# Altium schematic sheet relays2.SchDoc
size A4
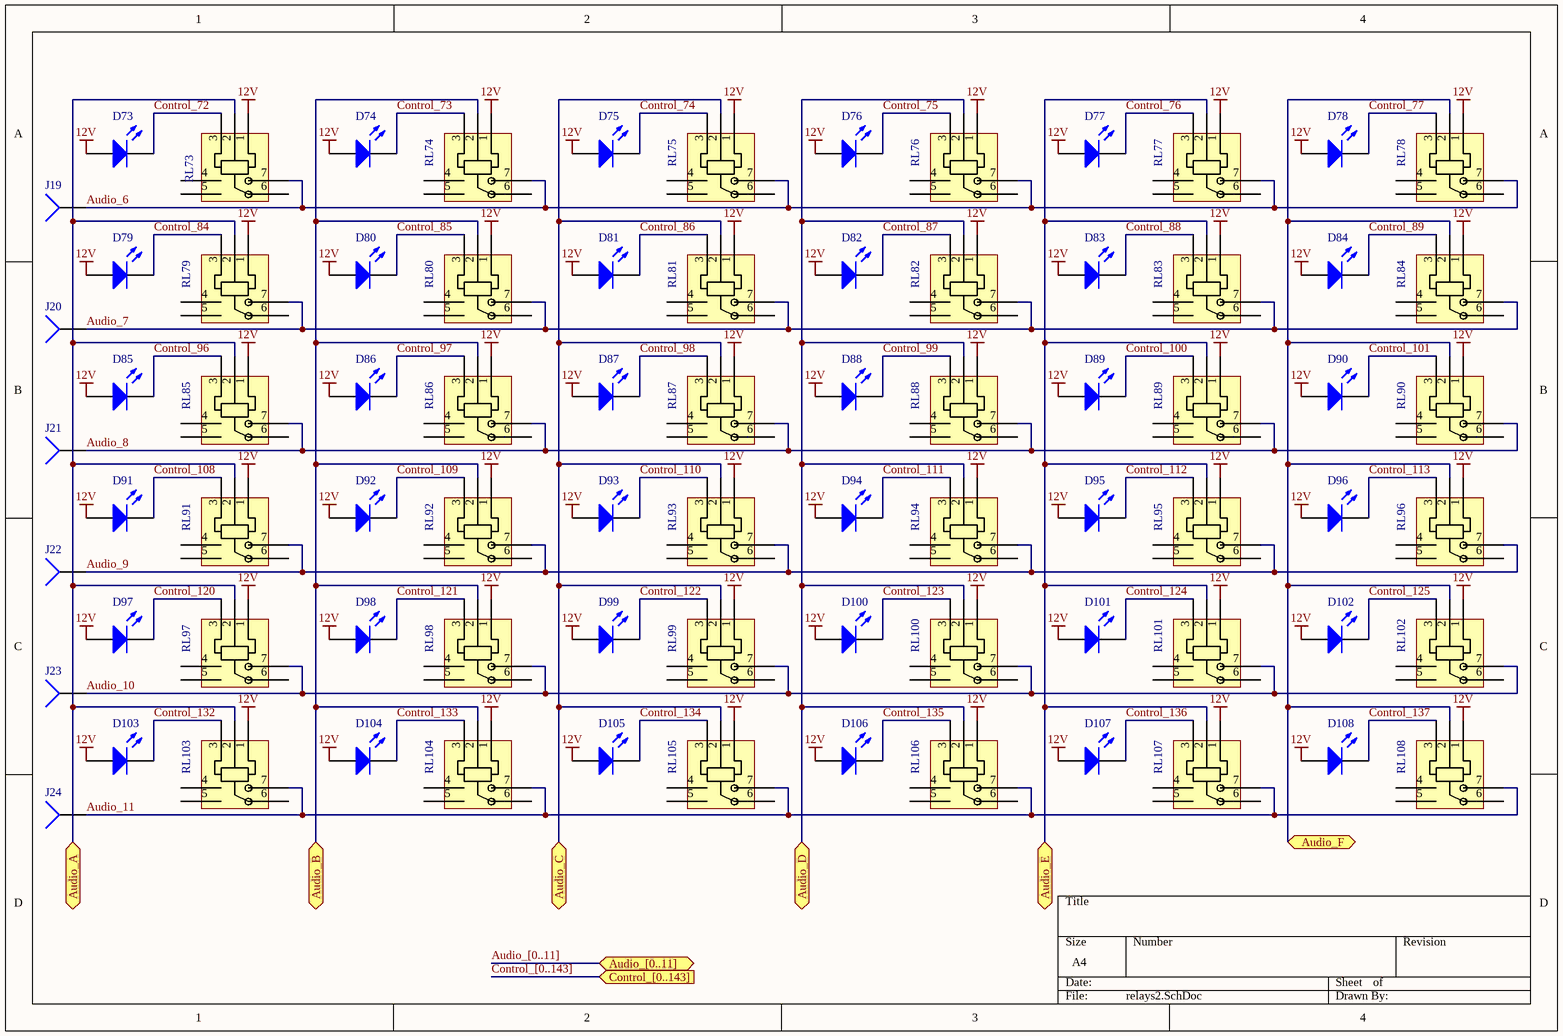
[diagram p0: relays2.SchDoc]

## Parts
D73  LED0  [LED_round_5mm]  (value not drawn)
D74  LED0  [LED_round_5mm]  (value not drawn)
D75  LED0  [LED_round_5mm]  (value not drawn)
D76  LED0  [LED_round_5mm]  (value not drawn)
D77  LED0  [LED_round_5mm]  (value not drawn)
D78  LED0  [LED_round_5mm]  (value not drawn)
D79  LED0  [LED_round_5mm]  (value not drawn)
D80  LED0  [LED_round_5mm]  (value not drawn)
D81  LED0  [LED_round_5mm]  (value not drawn)
D82  LED0  [LED_round_5mm]  (value not drawn)
D83  LED0  [LED_round_5mm]  (value not drawn)
D84  LED0  [LED_round_5mm]  (value not drawn)
D85  LED0  [LED_round_5mm]  (value not drawn)
D86  LED0  [LED_round_5mm]  (value not drawn)
D87  LED0  [LED_round_5mm]  (value not drawn)
D88  LED0  [LED_round_5mm]  (value not drawn)
D89  LED0  [LED_round_5mm]  (value not drawn)
D90  LED0  [LED_round_5mm]  (value not drawn)
D91  LED0  [LED_round_5mm]  (value not drawn)
D92  LED0  [LED_round_5mm]  (value not drawn)
D93  LED0  [LED_round_5mm]  (value not drawn)
D94  LED0  [LED_round_5mm]  (value not drawn)
D95  LED0  [LED_round_5mm]  (value not drawn)
D96  LED0  [LED_round_5mm]  (value not drawn)
D97  LED0  [LED_round_5mm]  (value not drawn)
D98  LED0  [LED_round_5mm]  (value not drawn)
D99  LED0  [LED_round_5mm]  (value not drawn)
D100  LED0  [LED_round_5mm]  (value not drawn)
D101  LED0  [LED_round_5mm]  (value not drawn)
D102  LED0  [LED_round_5mm]  (value not drawn)
D103  LED0  [LED_round_5mm]  (value not drawn)
D104  LED0  [LED_round_5mm]  (value not drawn)
D105  LED0  [LED_round_5mm]  (value not drawn)
D106  LED0  [LED_round_5mm]  (value not drawn)
D107  LED0  [LED_round_5mm]  (value not drawn)
D108  LED0  [LED_round_5mm]  (value not drawn)
J19  Audio  [Conn_1_2x4]  (value not drawn)
J20  Audio  [Conn_1_2x4]  (value not drawn)
J21  Audio  [Conn_1_2x4]  (value not drawn)
J22  Audio  [Conn_1_2x4]  (value not drawn)
J23  Audio  [Conn_1_2x4]  (value not drawn)
J24  Audio  [Conn_1_2x4]  (value not drawn)
RL73  Relay  [Relay_FRA3]  (value not drawn)
RL74  Relay  [Relay_FRA3]  (value not drawn)
RL75  Relay  [Relay_FRA3]  (value not drawn)
RL76  Relay  [Relay_FRA3]  (value not drawn)
RL77  Relay  [Relay_FRA3]  (value not drawn)
RL78  Relay  [Relay_FRA3]  (value not drawn)
RL79  Relay  [Relay_FRA3]  (value not drawn)
RL80  Relay  [Relay_FRA3]  (value not drawn)
RL81  Relay  [Relay_FRA3]  (value not drawn)
RL82  Relay  [Relay_FRA3]  (value not drawn)
RL83  Relay  [Relay_FRA3]  (value not drawn)
RL84  Relay  [Relay_FRA3]  (value not drawn)
RL85  Relay  [Relay_FRA3]  (value not drawn)
RL86  Relay  [Relay_FRA3]  (value not drawn)
RL87  Relay  [Relay_FRA3]  (value not drawn)
RL88  Relay  [Relay_FRA3]  (value not drawn)
RL89  Relay  [Relay_FRA3]  (value not drawn)
RL90  Relay  [Relay_FRA3]  (value not drawn)
RL91  Relay  [Relay_FRA3]  (value not drawn)
RL92  Relay  [Relay_FRA3]  (value not drawn)
RL93  Relay  [Relay_FRA3]  (value not drawn)
RL94  Relay  [Relay_FRA3]  (value not drawn)
RL95  Relay  [Relay_FRA3]  (value not drawn)
RL96  Relay  [Relay_FRA3]  (value not drawn)
RL97  Relay  [Relay_FRA3]  (value not drawn)
RL98  Relay  [Relay_FRA3]  (value not drawn)
RL99  Relay  [Relay_FRA3]  (value not drawn)
RL100  Relay  [Relay_FRA3]  (value not drawn)
RL101  Relay  [Relay_FRA3]  (value not drawn)
RL102  Relay  [Relay_FRA3]  (value not drawn)
RL103  Relay  [Relay_FRA3]  (value not drawn)
RL104  Relay  [Relay_FRA3]  (value not drawn)
RL105  Relay  [Relay_FRA3]  (value not drawn)
RL106  Relay  [Relay_FRA3]  (value not drawn)
RL107  Relay  [Relay_FRA3]  (value not drawn)
RL108  Relay  [Relay_FRA3]  (value not drawn)

## Ports
Audio_[0..11] (bidir), Audio_A (bidir), Audio_B (bidir), Audio_C (bidir), Audio_D (bidir), Audio_E (bidir), Audio_F (bidir), Control_[0..143] (in)

## Nets
12V: D73.1(A) D74.1(A) D75.1(A) D76.1(A) D77.1(A) D78.1(A) D79.1(A) D80.1(A) D81.1(A) D82.1(A) D83.1(A) D84.1(A) D85.1(A) D86.1(A) D87.1(A) D88.1(A) D89.1(A) D90.1(A) D91.1(A) D92.1(A) D93.1(A) D94.1(A) D95.1(A) D96.1(A) D97.1(A) D98.1(A) D99.1(A) D100.1(A) D101.1(A) D102.1(A) D103.1(A) D104.1(A) D105.1(A) D106.1(A) D107.1(A) D108.1(A) RL73.1 RL74.1 RL75.1 RL76.1 RL77.1 RL78.1 RL79.1 RL80.1 RL81.1 RL82.1 RL83.1 RL84.1 RL85.1 RL86.1 RL87.1 RL88.1 RL89.1 RL90.1 RL91.1 RL92.1 RL93.1 RL94.1 RL95.1 RL96.1 RL97.1 RL98.1 RL99.1 RL100.1 RL101.1 RL102.1 RL103.1 RL104.1 RL105.1 RL106.1 RL107.1 RL108.1
Audio_6: J19.1 RL73.7 RL74.7 RL75.7 RL76.7 RL77.7 RL78.7
Audio_7: J20.1 RL79.7 RL80.7 RL81.7 RL82.7 RL83.7 RL84.7
Audio_8: J21.1 RL85.7 RL86.7 RL87.7 RL88.7 RL89.7 RL90.7
Audio_9: J22.1 RL91.7 RL92.7 RL93.7 RL94.7 RL95.7 RL96.7
Audio_10: J23.1 RL97.7 RL98.7 RL99.7 RL100.7 RL101.7 RL102.7
Audio_11: J24.1 RL103.7 RL104.7 RL105.7 RL106.7 RL107.7 RL108.7
Audio_A: RL73.2 RL79.2 RL85.2 RL91.2 RL97.2 RL103.2 ; port Audio_A
Audio_B: RL74.2 RL80.2 RL86.2 RL92.2 RL98.2 RL104.2 ; port Audio_B
Audio_C: RL75.2 RL81.2 RL87.2 RL93.2 RL99.2 RL105.2 ; port Audio_C
Audio_D: RL76.2 RL82.2 RL88.2 RL94.2 RL100.2 RL106.2 ; port Audio_D
Audio_E: RL77.2 RL83.2 RL89.2 RL95.2 RL101.2 RL107.2 ; port Audio_E
Audio_F: RL78.2 RL84.2 RL90.2 RL96.2 RL102.2 RL108.2 ; port Audio_F
Control_72: D73.2(K) RL73.3
Control_73: D74.2(K) RL74.3
Control_74: D75.2(K) RL75.3
Control_75: D76.2(K) RL76.3
Control_76: D77.2(K) RL77.3
Control_77: D78.2(K) RL78.3
Control_84: D79.2(K) RL79.3
Control_85: D80.2(K) RL80.3
Control_86: D81.2(K) RL81.3
Control_87: D82.2(K) RL82.3
Control_88: D83.2(K) RL83.3
Control_89: D84.2(K) RL84.3
Control_96: D85.2(K) RL85.3
Control_97: D86.2(K) RL86.3
Control_98: D87.2(K) RL87.3
Control_99: D88.2(K) RL88.3
Control_100: D89.2(K) RL89.3
Control_101: D90.2(K) RL90.3
Control_108: D91.2(K) RL91.3
Control_109: D92.2(K) RL92.3
Control_110: D93.2(K) RL93.3
Control_111: D94.2(K) RL94.3
Control_112: D95.2(K) RL95.3
Control_113: D96.2(K) RL96.3
Control_120: D97.2(K) RL97.3
Control_121: D98.2(K) RL98.3
Control_122: D99.2(K) RL99.3
Control_123: D100.2(K) RL100.3
Control_124: D101.2(K) RL101.3
Control_125: D102.2(K) RL102.3
Control_132: D103.2(K) RL103.3
Control_133: D104.2(K) RL104.3
Control_134: D105.2(K) RL105.3
Control_135: D106.2(K) RL106.3
Control_136: D107.2(K) RL107.3
Control_137: D108.2(K) RL108.3

Not connected (* = marked no-connect by the designer): RL73 4 5 6; RL74 4 5 6; RL75 4 5 6; RL76 4 5 6; RL77 4 5 6; RL78 4 5 6; RL79 4 5 6; RL80 4 5 6; RL81 4 5 6; RL82 4 5 6; RL83 4 5 6; RL84 4 5 6; RL85 4 5 6; RL86 4 5 6; RL87 4 5 6; RL88 4 5 6; RL89 4 5 6; RL90 4 5 6; RL91 4 5 6; RL92 4 5 6; RL93 4 5 6; RL94 4 5 6; RL95 4 5 6; RL96 4 5 6; RL97 4 5 6; RL98 4 5 6; RL99 4 5 6; RL100 4 5 6; RL101 4 5 6; RL102 4 5 6; RL103 4 5 6; RL104 4 5 6; RL105 4 5 6; RL106 4 5 6; RL107 4 5 6; RL108 4 5 6

## Buses and harness runs
bus Audio_[0..11] = port Audio_[0..11]
bus Control_[0..143] = port Control_[0..143]

## Library data of the parts
D73-D108 = LED0: Typical INFRARED GaAs LED; Published: 8-Jun-2000; LatestRevisionDate: 08-Jul-2005; LatestRevisionNote: Mech Layer 1 removed.; PackageReference: LED-0; Publisher: Altium Limited; PackageDescription: LED; 2 Leads
J19-J24 = Socket: LatestRevisionDate: 17-Jul-2002; LatestRevisionNote: Re-released for DXP Platform.; Publisher: Altium Limited
RL73-RL108 = Relay_FRA3: Miniature power relay; Part number: FRA3C-DC12